# EAGLE design fitnessBuddy-BOTTOM (EAGLE 9.6.2)
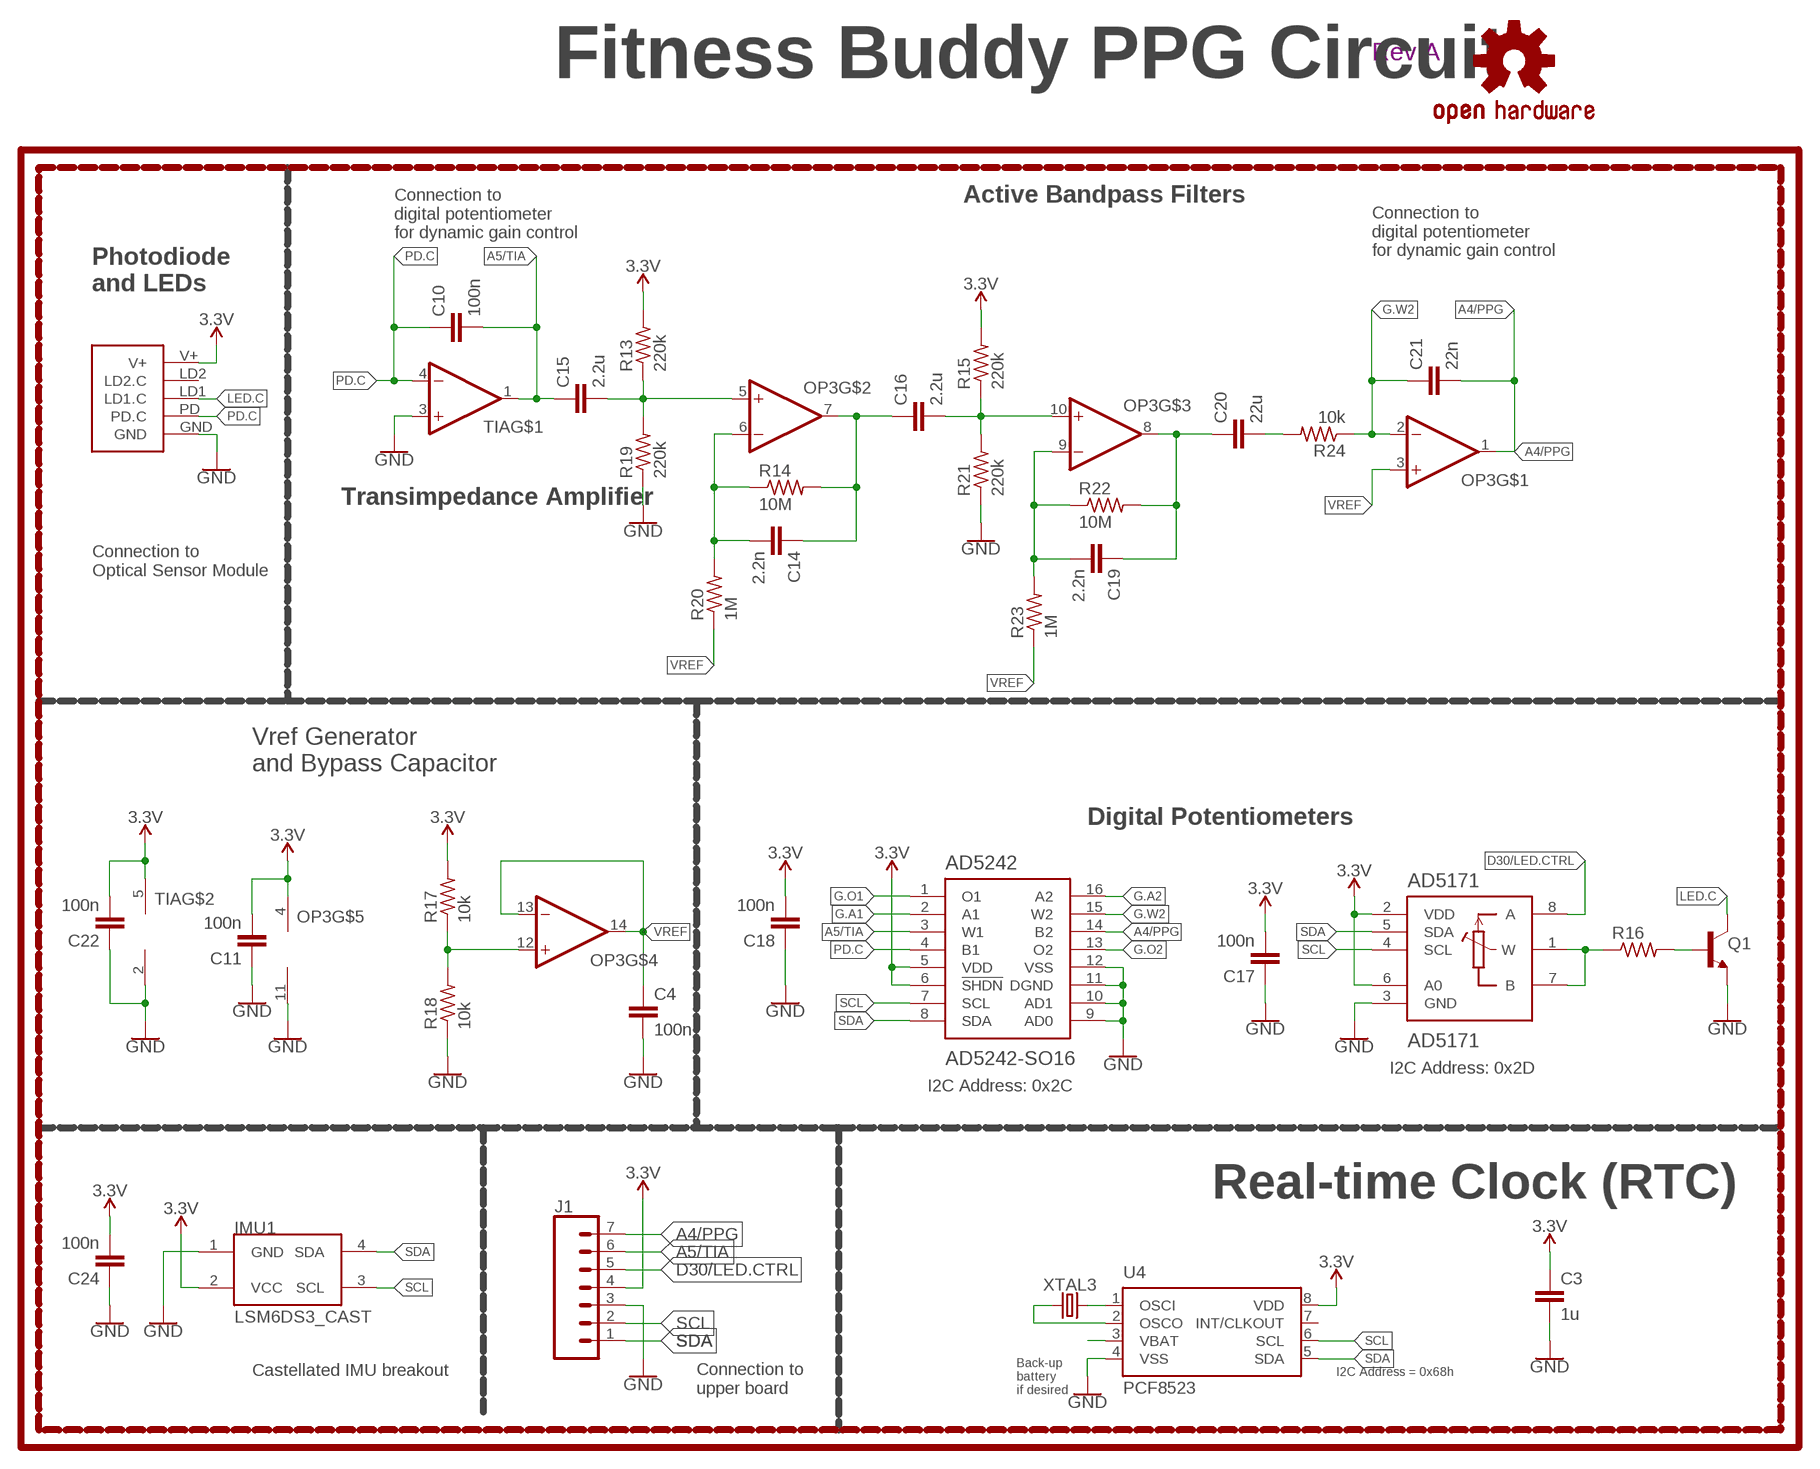
[diagram p0: schematic, sheet 1]

## Parts
AD5171  AD5171  [SOT-23-8]
AD5242  AD5242-SO16  [SO16]
C3  1u  CAPACITOR0603  [C0603]
C4  100n  CAPACITOR0603  [C0603]
C10  100n  CAPACITOR0603  [C0603]
C11  100n  CAPACITOR0603  [C0603]
C14  2.2n  CAPACITOR0603  [C0603]
C15  2.2u  CAPACITOR0603  [C0603]
C16  2.2u  CAPACITOR0603  [C0603]
C17  100n  CAPACITOR0603  [C0603]
C18  100n  CAPACITOR0603  [C0603]
C19  2.2n  CAPACITOR0603  [C0603]
C20  22u  CAPACITOR0603  [C0603]
C21  22n  CAPACITOR0603  [C0603]
C22  100n  CAPACITOR0603  [C0603]
C24  100n  CAPACITOR0603  [C0603]
IMU1  LSM6DS3_CAST  [LSM6DS3_CAST]
J1  CONN_07-1.27MM  [1X07_1.27MM]
LOGO1  REVISION.A  [REV.A]
LOGO2  OSHW-LOGOS  [OSHW-LOGO-S]
OP3  OP-QUAD-SO14  [SO14]
Q1  NPN-GENERIC  [SOT23-3]
R13  220k  RESISTOR0603  [R0603]
R14  10M  RESISTOR0603  [R0603]
R15  220k  RESISTOR0603  [R0603]
R16  RESISTOR0603  [R0603]
R17  10k  RESISTOR0402  [R0402]
R18  10k  RESISTOR0402  [R0402]
R19  220k  RESISTOR0603  [R0603]
R20  1M  RESISTOR0603  [R0603]
R21  220k  RESISTOR0603  [R0603]
R22  10M  RESISTOR0603  [R0603]
R23  1M  RESISTOR0603  [R0603]
R24  10k  RESISTOR0603  [R0603]
TIA  OP-SINGLEOT  [SOT23-5]
U4  PCF8523  [SO8]
U$3  PPG.MODULE.2  [PPG.MODULE.2]
XTAL3  32.7680kHz  CRYSTALECS-.327-12.5-12-C-TR  [2-SMD.NOLEAD.2.0MMTO1.2MM]

## Nets
3.3V: AD5171.2(VDD) AD5171.6(A0) AD5242.5(VDD) AD5242.6(!SHDN) C3.1 C11.2 C17.2 C18.2 C22.2 C24.2 IMU1.2(VCC) J1.4 OP3.4(V+) R13.2 R15.2 R17.2 TIA.5(V+) U4.8(VDD) U$3.V+
A4/PPG: AD5242.14(B2) C21.2 J1.7 OP3.1(OUT)
A5/TIA: AD5242.3(W1) C10.2 C15.1 J1.6 TIA.1(OUT)
D30/LED.CTRL: AD5171.8(A) J1.5
G.A1: AD5242.2(A1)
G.A2: AD5242.16(A2)
G.O1: AD5242.1(O1)
G.O2: AD5242.13(O2)
G.W2: AD5242.15(W2) C21.1 OP3.2(-IN) R24.1
GND: AD5171.3(GND) AD5242.9(AD0) AD5242.10(AD1) AD5242.11(DGND) AD5242.12(VSS) C3.2 C4.2 C11.1 C17.1 C18.1 C22.1 C24.1 IMU1.1(GND) J1.3 OP3.11(V-) Q1.2(E) R18.1 R19.1 R21.1 TIA.2(V-) TIA.3(+IN) U4.4(VSS) U$3.GND
LED.C: Q1.3(C) U$3.LD1(LD1.C)
N$5: U4.2(OSCO) XTAL3.P$1
N$6: U4.1(OSCI) XTAL3.P$2
N$8: Q1.1(B) R16.2
N$9: AD5171.1(W) AD5171.7(B) R16.1
N$10: OP3.12(+IN) R17.1 R18.2
N$13: C15.2 OP3.5(+IN) R13.1 R19.2
N$15: C14.2 OP3.6(-IN) R14.1 R20.2
N$16: C14.1 C16.1 OP3.7(OUT) R14.2
N$17: C16.2 OP3.10(+IN) R15.1 R21.2
N$18: C19.2 OP3.9(-IN) R22.1 R23.2
N$19: C19.1 C20.1 OP3.8(OUT) R22.2
N$20: C20.2 R24.2
PD.C: AD5242.4(B1) C10.1 TIA.4(-IN) U$3.PD(PD.C)
SCL: AD5171.4(SCL) AD5242.7(SCL) IMU1.3(SCL) J1.2 U4.6(SCL)
SDA: AD5171.5(SDA) AD5242.8(SDA) IMU1.4(SDA) J1.1 U4.5(SDA)
VBATT: U4.3(VBAT)
VREF: C4.1 OP3.3(+IN) OP3.13(-IN) OP3.14(OUT) R20.1 R23.1
Unconnected: U4.7(INT/CLKOUT) U$3.LD2(LD2.C)

## Notes on the sheet
- Fitness Buddy PPG Circuit
- Active Bandpass Filters
- Connection to
  digital potentiometer
  for dynamic gain control
- Connection to
  digital potentiometer
  for dynamic gain control
- Photodiode
  and LEDs
- Transimpedance Amplifier
- Connection to 
  Optical Sensor Module
- Vref Generator
  and Bypass Capacitor
- Digital Potentiometers
- I2C Address: 0x2D
- I2C Address: 0x2C
- Real-time Clock (RTC)
- Castellated IMU breakout | I2C Address = 0x68h
- Connection to
  upper board
- Back-up
  battery
  if desired

## Library data of the parts
AD5171 = LinnesLab-DigitalIC:AD5171
AD5242 = LinnesLab-DigitalIC:AD5242
C3 C4 C10 C11 C14-C22 C24 = LinnesLab-Passives:CAPACITOR
IMU1 = LinnesLab-Sensors:LSM6DS3_CAST
J1 = LinnesLab-Connectors:CONN_07: Multi connection point. Often used as Generic Header-pin footprint for 0.1 inch spaced/style header connections On any of the 0.1 inch spaced packages, you can populate with these: Break Away Headers - Straight <https://www.sparkfun.com/products/116> (PRT-00116) Break Away Male Headers - Right Angle <https://www.sparkfun.com/products/553> (PRT-00553) Female Headers <https://www.sparkfun.com/products/115> (PRT-00115) Break Away Headers - Machine Pin <https://www.sparkfun.com/products/117> (PRT-00117) Break Away Female Headers - Swiss Machine Pin <https://www.sparkfun.com/products/743> (PRT-00743) For SCREWTERMINALS and SPRING TERMINALS visit here: Screw Terimnals on SparkFun.com <https://www.sparkfun.com/search/results?term=Screw+Terminals> (5mm/3.5mm/2.54mm spacing) This device is also useful as a general connection point to wire up your design to another part of your project. Our various solder wires solder well into these plated through hole pads. Hook-Up Wire - Assortment (Stranded, 22 AWG) <https://www.sparkfun.com/products/11375> (PRT-11375) Hook-Up Wire - Assortment (Solid Core, 22 AWG) <https://www.sparkfun.com/products/11367> (PRT-11367) View the entire wire category on our website here <https://www.sparkfun.com/categories/141> Special notes: Molex polarized connector foot print use with SKU : PRT-08231 with associated crimp pins and housings. 1MM SMD Version SKU: PRT-10208 NOTES ON THE VARIANTS LOCK and LOCK_LONGPADS... This footprint was designed to help hold the alignment of a through-hole component (i.e. 6-pin header) while soldering it into place. You may notice that each hole has been shifted either up or down by 0.005 of an inch from it's more standard position (which is a perfectly straight line). This slight alteration caused the pins (the squares in the middle) to touch the edges of the holes. Because they are alternating, it causes a "brace" to hold the component in place. 0.005 has proven to be the perfect amount of "off-center" position when using our standard breakaway headers. Although looks a little odd when you look at the bare footprint, once you have a header in there, the alteration is very hard to notice. Also,if you push a header all the way into place, it is covered up entirely on the bottom side.
LOGO1 = LinnesLab-Logos:REVISION.A
LOGO2 = LinnesLab-Logos:OSHW-LOGO: Open-Source Hardware (OSHW) Logo This logo indicates the piece of hardware it is found on incorporates a OSHW license and/or adheres to the definition of open source hardware found here: http://freedomdefined.org/OSHW
OP3 = LinnesLab-AnalogIC:OP-QUAD: General symbol and footprints for Quad Op Amps. Use with any standard general purpose op amp.
Q1 = LinnesLab-DiscreteSemi:NPN
R13-R24 = LinnesLab-Passives:RESISTOR
TIA = LinnesLab-AnalogIC:OP-SINGLE: Single Op Amp 2.7V to 6.0V Single Supply CMOS Source: http://ww1.microchip.com/downloads/en/DeviceDoc/21314g.pdf
U4 = LinnesLab-Clocks:PCF8523; DIGIKEY: 568-5306-1-ND; I2C_ADDRESS: 0x68h; MFN: PCF8523T/1,118; MFN_MANUFACTURER: NXP USA Inc.
U$3 = LinnesLab-Connectors:PPG.MODULE.2: Digi-Key Part Number: S9014E-50-ND Manufacturer Part Number: GRPB501VWVN-RC Description: 1mm insulation height 0.05in pitch 50 positions
XTAL3 = LinnesLab-Clocks:CRYSTAL

## Board
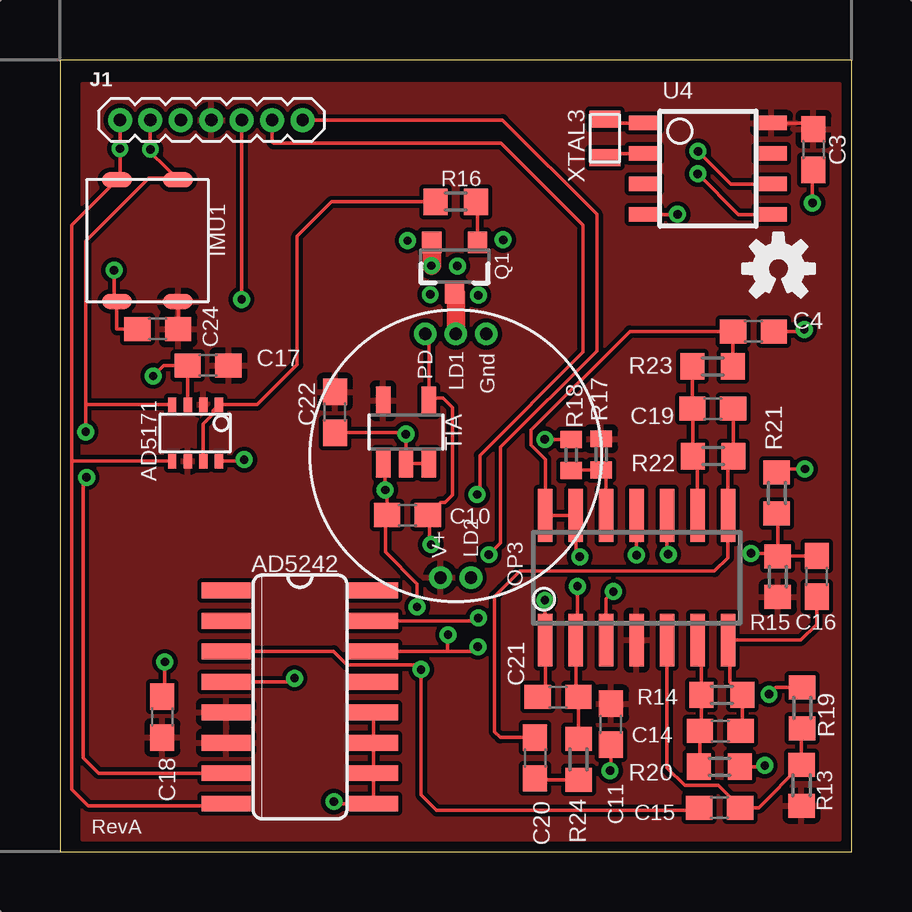
[diagram p1: board, top side]
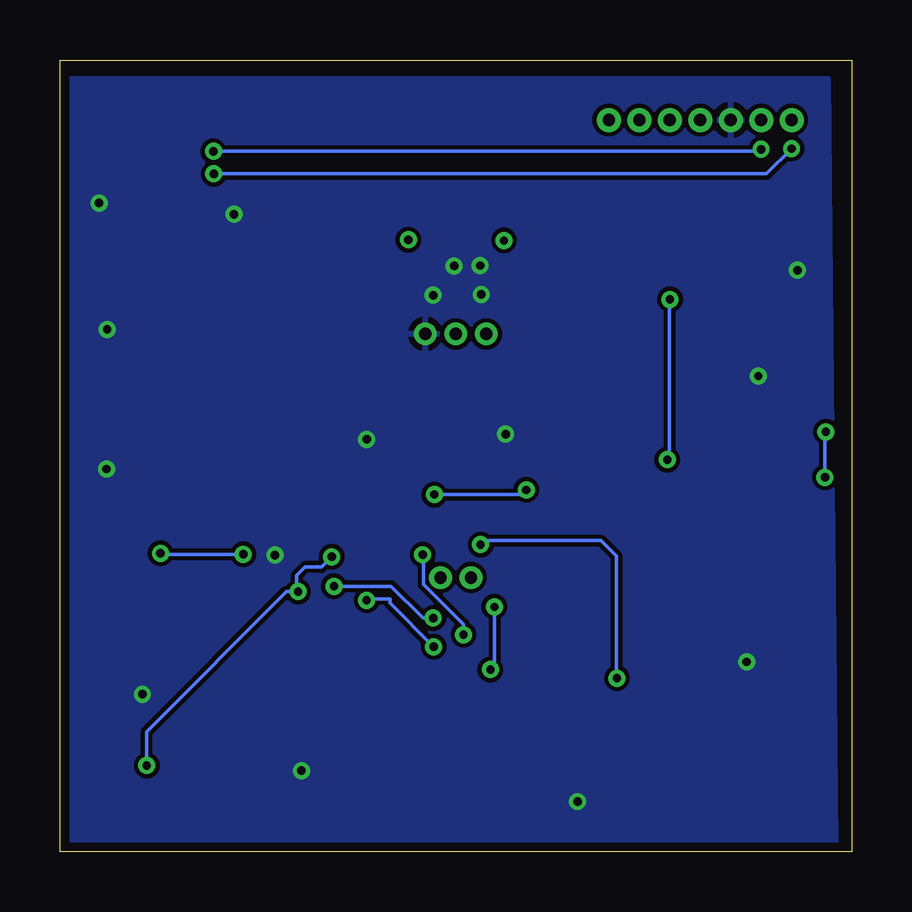
[diagram p2: board, bottom side, seen from below]

Size 33 x 33 mm. Coordinates in mm from the lower left corner, seen from the top.
Outline: 0,0 33,0 33,33 0,33 0,0
Copper layers (1*16): Top 0.0356mm / dielectric 1.5011mm / Bottom 0.0356mm
Design rules "LaenPCBOrder": minimum track width 6mil, minimum drill 13mil, track to track 6mil, track to pad 6mil, pad to pad 6mil, via to via 6mil, smd to smd 6mil, copper to edge 15mil, drill to drill 6mil, minimum pad ring 7mil, minimum via ring 7mil, stop-mask expansion 3mil, vias tented up to drill 0mil, thermal gap 10mil

### Footprints (pad centres in the part's own frame; a part is rotated, then mirrored left to right if it is on the bottom)
SOT-23-8 = smd 0.35 x 0.6: 1 -0.991,-1.176; 2 -0.341,-1.176; 3 0.309,-1.176; 4 0.959,-1.176; 5 0.959,1.176; 6 0.309,1.176; 7 -0.341,1.176; 8 -0.991,1.176
SO16 = smd 0.66 x 2.032: 1 -4.445,-3.073; 2 -3.175,-3.073; 3 -1.905,-3.073; 4 -0.635,-3.073; 5 0.635,-3.073; 6 1.905,-3.073; 7 3.175,-3.073; 8 4.445,-3.073; 9 4.445,3.073; 10 3.175,3.073; 11 1.905,3.073; 12 0.635,3.073; 13 -0.635,3.073; 14 -1.905,3.073; 15 -3.175,3.073; 16 -4.445,3.073
C0603 = smd 1.1 x 1: 1 -0.85,0; 2 0.85,0
LSM6DS3_CAST = smd 0.635 x 1.27: 1 -2.54,1.27; 2 -2.54,-1.27; 3 2.54,-1.27; 4 2.54,1.27
1X07_1.27MM = drill 0.508 pad 1: 1 0,0; 2 1.27,0; 3 2.54,0; 4 3.81,0; 5 5.08,0; 6 6.35,0; 7 7.62,0
SO14 = smd 0.6 x 2.2: 1 -3.81,-2.6; 2 -2.54,-2.6; 3 -1.27,-2.6; 4 0,-2.6; 5 1.27,-2.6; 6 2.54,-2.6; 7 3.81,-2.6; 8 3.81,2.6; 9 2.54,2.6; 10 1.27,2.6; 11 0,2.6; 12 -1.27,2.6; 13 -2.54,2.6; 14 -3.81,2.6
SOT23-3 = smd 0.8 x 0.9: 1 -0.95,-1; 2 0.95,-1; 3 0,1.1
R0603 = smd 1 x 1.1: 1 -0.85,0; 2 0.85,0
R0402 = smd 0.7 x 0.9: 1 -0.65,0; 2 0.65,0
SOT23-5 = smd 0.6 x 1.2: 1 -0.95,-1.306; 2 0,-1.306; 3 0.95,-1.306; 4 0.95,1.306; 5 -0.95,1.306
SO8 = smd 1.3 x 0.6: 1 -2.65,1.905; 2 -2.65,0.635; 3 -2.65,-0.635; 4 -2.65,-1.905; 5 2.65,-1.905; 6 2.65,-0.635; 7 2.65,0.635; 8 2.65,1.905
PPG.MODULE.2 = drill 0.508 pad 0.94: GND 1.27,5.08; LD1 0,5.08; LD2 0.635,-5.08; PD -1.27,5.08; V+ -0.635,-5.08
2-SMD.NOLEAD.2.0MMTO1.2MM = smd 0.7 x 1.3: P$1 -0.8,0; P$2 0.8,0

### Placement (x,y rotation side)
AD5171  5.64,17.45 180 top
AD5242  10,6.44 270 top
C3  31.41,29.27 270 top
C4  28.91,21.68 0 top
C10  14.48,14.03 180 top
C11  22.97,5.31 90 top
C14  27.53,5.03 180 top
C15  27.5,1.83 0 top
C16  31.55,11.47 90 top
C17  6.17,20.27 0 top
C18  4.27,5.61 270 top
C19  27.21,18.47 180 top
C20  19.81,3.9 270 top
C21  20.76,6.44 180 top
C22  11.46,18.32 90 top
C24  4.08,21.78 0 top
IMU1  3.65,25.47 90 top
J1  2.5,30.5 0 top
LOGO1  1.32,0.74 0 top
LOGO2  29.95,24.3 0 top
OP3  24.04,11.41 0 top
Q1  16.45,24.4 180 top
R13  30.92,2.76 270 top
R14  27.59,6.53 0 top
R15  29.92,11.46 270 top
R16  16.5,27.09 0 top
R17  22.56,16.56 90 top
R18  21.32,16.53 270 top
R19  30.94,5.99 270 top
R20  27.49,3.54 180 top
R21  29.88,14.95 270 top
R22  27.23,16.49 0 top
R23  27.21,20.23 180 top
R24  21.62,3.84 270 top
TIA  14.43,17.49 0 top
U4  27.01,28.47 0 top
U$3  16.5,16.5 0 top
XTAL3  22.72,29.73 90 top

### Tracks (layer width: path | path; a pad name or v marks a point on that pad's centre or on a via)
3.3V
  Top 0.152: 6.92,5.79 AD5242.5 | IMU1.2 4.92,21.79 C24.2 | U4.8 31.16,30.37 C3.1
  pour Top (isolate 0.178): 0.93,32.02 32.5,32.02 32.5,0.5 0.93,0.5
A4/PPG  (via drill 0.35)
  Top 0.152: C21.2 20.23,6.76 OP3.1 20.22,8.83 v20.22,10.48 | v17.42,8.54 17.23,8.35 16.15,8.35 | 16.15,8.35 AD5242.14 | J1.7 18.46,30.5 22.38,26.57 22.38,20.87 18.37,16.86 18.37,12.86 v17.88,12.37 | v16.18,9.04 16.15,9.01 16.15,8.35
  Bottom 0.152: v17.42,8.54 19.25,10.37 19.25,10.53 20.17,10.53 v20.22,10.48 | v17.88,12.37 17.83,12.33 17.83,11.13 16.18,9.47 v16.18,9.04
A5/TIA  (via drill 0.35)
  Top 0.152: TIA.1 13.56,16.1 v13.56,15.07 13.64,15 C10.2 13.57,13.97 13.57,12.48 14.89,11.16 v14.89,10.2 | C15.1 26.53,1.72 15.7,1.72 15.05,2.37 v15.05,7.59 14.85,7.79 11.97,7.79 11.41,8.35 AD5242.3 | v17.39,14.88 17.5,14.88 17.5,16.52 21.81,20.82 21.81,26.11 18.39,29.52 18.16,29.52 18.16,29.53 8.9,29.53 8.85,29.58 J1.6
  Bottom 0.152: v14.89,10.2 14.89,7.76 v15.05,7.59 | v17.39,14.88 13.75,14.88 v13.56,15.07
D30/LED.CTRL  (via drill 0.35)
  Top 0.152: AD5171.8 7.61,16.27 v7.68,16.34 | J1.5 v7.57,23.01
  Bottom 0.152: v7.68,16.34 7.6,16.41 7.6,22.98 v7.57,23.01
G.W2  (via drill 0.35)
  Top 0.152: OP3.2 21.5,8.7 | 21.5,8.7 21.5,6.55 C21.1 R24.1 | v17.44,9.73 17.32,9.62 AD5242.15 | v21.57,11.06 v21.57,11.05 21.57,8.77 21.5,8.7
  Bottom 0.152: v17.44,9.73 17.87,9.73 19.19,11.06 v21.57,11.06
GND  (via drill 0.35)
  Top 0.152: R18.1 v20.22,17.18 v20.21,17.18 | OP3.11 v24.04,12.36 | R19.1 29.84,6.84 v29.56,6.56 | C11.1 22.97,3.41 v22.93,3.37 | TIA.2 14.43,16.19 | 14.43,16.19 v14.43,17.4 v14.42,17.4 14.36,17.46 C22.1 | TIA.3 TIA.2 14.43,16.19 | AD5242.12 AD5242.11 AD5242.10 AD5242.9 11.51,2 v11.42,2.08 | C18.1 4.37,6.56 v4.37,7.91 | IMU1.1 2.25,23.05 v2.25,24.23 | 2.25,22.79 IMU1.1 | C24.1 2.38,21.78 2.37,21.79 IMU1.1 | AD5171.3 C17.1 4.33,20.27 v3.89,19.82 | R21.1 30.03,15.95 v31.06,15.95 | U4.4 v25.73,26.56 v25.74,26.57 | C3.2 31.37,28.38 v31.37,27.04 | v31.37,27.04 | C4.2 30.95,21.68 v31.03,21.77
  Top 0.762: Q1.2 15.5,24.45 v15.48,24.43
  other vias: 17.44,23.19 15.44,23.23 16.57,24.41
  pour Bottom (isolate 0.178): 0.96,32.26 32.71,32.26 32.71,0.25 0.61,0.25 0.94,32.24
LED.C
  Top 0.762: Q1.3 16.5,23.26 U$3.LD1
N$2  (via drill 0.35)
  other vias: 14.49,25.47
N$3  (via drill 0.35)
  other vias: 18.48,25.5
N$5
  Top 0.152: U4.2 22.89,29.1 XTAL3.P$1
N$6
  Top 0.152: U4.1 22.88,30.37 XTAL3.P$2
N$8
  Top 0.152: R16.2 17.4,27.04 Q1.1
N$9
  Top 0.152: R16.1 11.33,27.09 9.89,25.65 9.89,20.3 8.21,18.63 AD5171.1 6.38,18.38 6.38,18.23 5.98,17.83 AD5171.7
N$10
  Top 0.152: R18.2 21.34,15.91 R17.1 22.77,15.7 OP3.12
N$13
  Top 0.152: R19.2 30.92,5.11 R13.1 29.14,1.83 28.37,1.83 | 28.37,1.83 C15.2 | 28.37,1.83 27.45,2.76 26.05,2.76 25.31,3.5 OP3.5
N$15
  Top 0.152: OP3.6 26.74,8.65 R14.1 26.74,5.09 C14.2 26.68,3.57 R20.2
N$16
  Top 0.152: C14.1 28.44,5.09 R14.2 27.92,7.05 27.92,8.74 OP3.7 30.88,8.81 31.55,9.48 C16.1
N$17  (via drill 0.35)
  Top 0.152: C16.2 29.93,12.32 R15.1 | R15.1 29.92,14.06 R21.2 | OP3.10 25.31,12.44 v25.36,12.39 | v28.81,12.43 29.8,12.43 R15.1
  Bottom 0.152: v25.36,12.39 28.77,12.39 v28.81,12.43
N$18
  Top 0.152: OP3.9 26.58,16.29 R22.1 26.38,18.45 C19.2 R23.2
N$19
  Top 0.152: C20.1 18.36,4.75 18.12,5 18.12,10.64 19.17,11.69 27.29,11.69 27.85,12.25 OP3.8 27.85,16.25 R22.2 28.08,18.45 C19.1
N$20
  Top 0.152: R24.2 19.87,2.99 C20.2
PD.C  (via drill 0.35)
  Top 0.152: U$3.PD 15.38,21.43 15.38,18.9 | 15.38,18.9 TIA.4 | 15.38,18.9 15.98,18.9 16.36,18.51 16.36,14.87 16.05,14.55 15.86,14.55 C10.1 15.4,13.97 15.4,12.86 v15.47,12.8 | AD5242.4 9.63,7.08 v9.78,7.23
  Bottom 0.152: v9.78,7.23 9.8,7.25 9.8,12.31 10.45,12.96 15.3,12.96 v15.47,12.8
SCL  (via drill 0.35)
  Top 0.152: J1.2 v3.77,29.27 3.77,29.16 4.42,28.5 4.85,28.08 | 4.85,28.08 IMU1.3 | AD5242.7 1.62,3.27 0.98,3.91 0.98,15.47 v1.11,15.6 | 4.85,28.08 3.71,28.08 1.07,25.44 1.07,18.7 | v1.07,17.5 1.07,18.7 | AD5171.4 1.14,18.63 1.07,18.7 | U4.6 27.96,27.83 v26.6,29.19
  Bottom 0.152: v1.11,15.6 1.11,17.46 v1.07,17.5 | v26.6,29.19 3.86,29.19 v3.77,29.27
SDA  (via drill 0.35)
  Top 0.152: J1.1 v2.5,29.3 2.5,28.13 IMU1.4 0.49,26.12 0.49,16.27 | AD5242.8 6.84,1.91 1.17,1.91 0.49,2.59 0.49,16.27 | AD5171.5 0.49,16.27 | U4.5 28.29,26.56 v26.59,28.26
  Bottom 0.152: v26.59,28.26 3.55,28.26 v2.5,29.3
VREF  (via drill 0.35)
  Top 0.152: R20.1 29.33,3.54 v29.39,3.59 | v23.07,10.84 22.77,10.54 OP3.3 | v21.67,12.29 21.5,12.45 OP3.13 OP3.14 20.23,16.35 19.63,16.94 19.63,17.57 23.75,21.68 C4.1 R23.1
  Bottom 0.152: v29.39,3.59 29.39,5 23.54,10.84 23.13,10.84 | 23.13,10.84 v23.07,10.84 | v21.67,12.29 22.09,11.86 22.79,11.86 23.13,11.51 23.13,10.84